# EAGLE design quad_copter_duino (EAGLE 5.06)
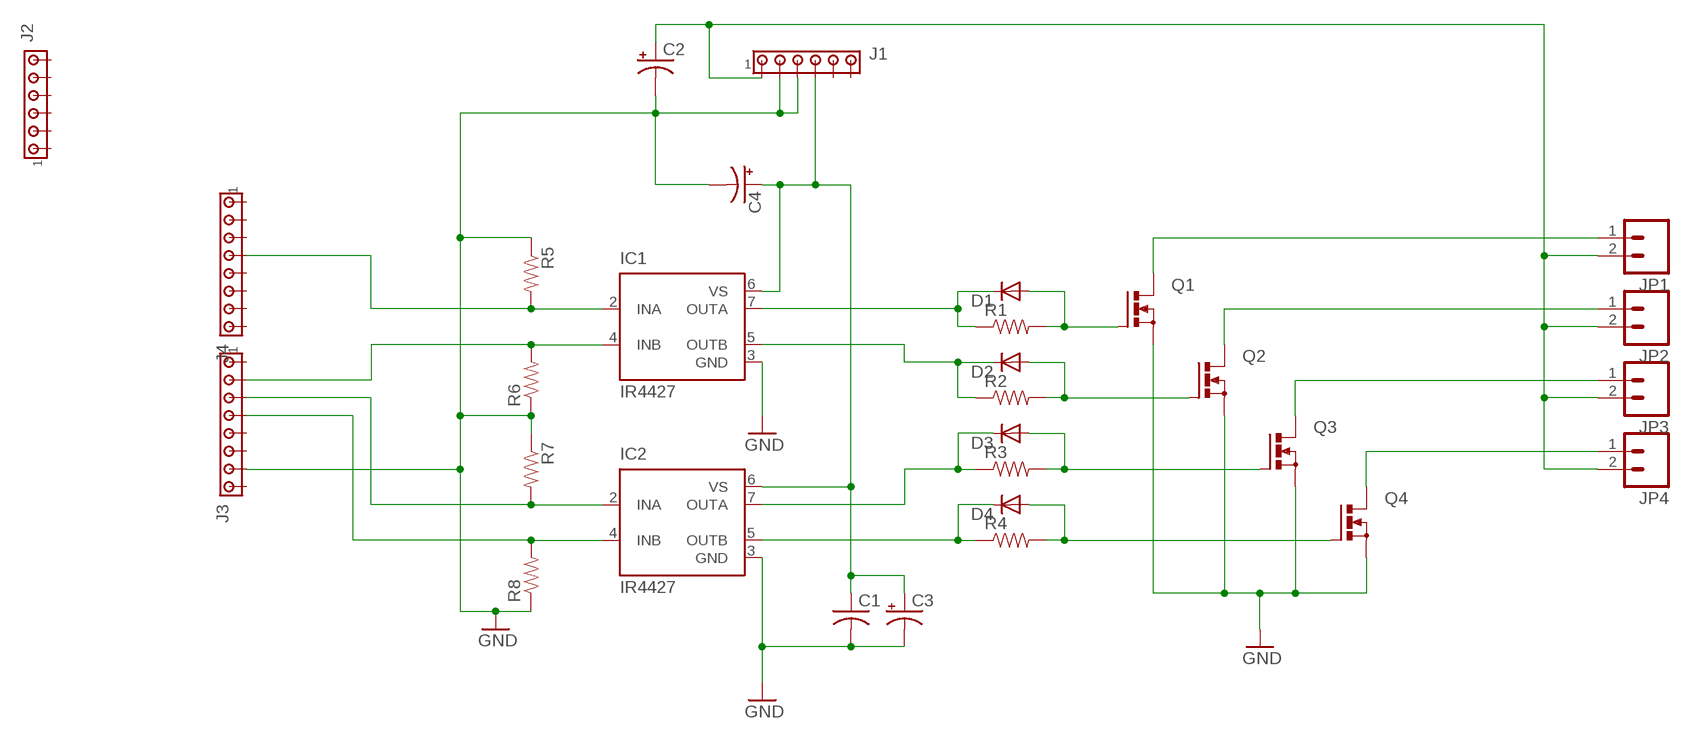
[diagram p0: schematic, sheet 1]

## Parts
C1  C-US025-025X050  [C025-025X050]
C2  CPOL-USE5-10.5  [E5-10,5]
C3  CPOL-USE5-10.5  [E5-10,5]
C4  CPOL-USE2.5-7  [E2,5-7]
D1  DIODE1N4148  [DIODE-1N4148]
D2  DIODE1N4148  [DIODE-1N4148]
D3  DIODE1N4148  [DIODE-1N4148]
D4  DIODE1N4148  [DIODE-1N4148]
IC1  IR4427  [DIL08]
IC2  IR4427  [DIL08]
J1  MTA06-100  [10X06MTA]
J2  MTA06-100  [10X06MTA]
J3  MTA08-100  [10X08MTA]
J4  MTA08-100  [10X08MTA]
JP1  M02PTH  [1X02]
JP2  M02PTH  [1X02]
JP3  M02PTH  [1X02]
JP4  M02PTH  [1X02]
Q1  PMOSFET_NTO220BV  [TO220BV]
Q2  PMOSFET_NTO220BV  [TO220BV]
Q3  PMOSFET_NTO220BV  [TO220BV]
Q4  PMOSFET_NTO220BV  [TO220BV]
R1  RESISTORPTH1  [AXIAL-0.3]
R2  RESISTORPTH1  [AXIAL-0.3]
R3  RESISTORPTH1  [AXIAL-0.3]
R4  RESISTORPTH1  [AXIAL-0.3]
R5  RESISTORPTH-1/6W  [1/6W-RES]
R6  RESISTORPTH-1/6W  [1/6W-RES]
R7  RESISTORPTH-1/6W  [1/6W-RES]
R8  RESISTORPTH-1/6W  [1/6W-RES]

## Nets
GND: C1.2 C2.- C3.- C4.- IC1.3(GND) IC2.3(GND) J1.4 J1.5 J3.7 Q1.S Q2.S Q3.S Q4.S R5.1 R6.1 R7.1 R8.1
N$1: C1.1 C3.+ C4.+ IC1.6(VS) IC2.6(VS) J1.3
N$2: C2.+ J1.6 JP1.2 JP2.2 JP3.2 JP4.2
N$9: JP4.1 Q4.D
N$10: JP3.1 Q3.D
N$11: JP2.1 Q2.D
N$12: JP1.1 Q1.D
N$13: D1.A Q1.G R1.P$2
N$14: D2.A Q2.G R2.P$2
N$15: D3.A Q3.G R3.P$2
N$16: D4.A Q4.G R4.P$2
N$17: D4.C IC2.5(OUTB) R4.P$1
N$18: D3.C IC2.7(OUTA) R3.P$1
N$19: D2.C IC1.5(OUTB) R2.P$1
N$20: D1.C IC1.7(OUTA) R1.P$1
N$21: IC2.4(INB) J3.4 R8.2
N$22: IC2.2(INA) J3.3 R7.2
N$23: IC1.4(INB) J3.2 R6.2
N$24: IC1.2(INA) J4.4 R5.2
Unconnected: J1.1 J1.2 J2.1 J2.2 J2.3 J2.4 J2.5 J2.6 J3.1 J3.5 J3.6 J3.8 J4.1 J4.2 J4.3 J4.5 J4.6 J4.7 J4.8

## Library data of the parts
C1 = rcl:C-US: CAPACITOR, American symbol
C2-C4 = rcl:CPOL-US: POLARIZED CAPACITOR, American symbol
D1-D4 = SparkFun:DIODE: Diode These are standard reverse protection diodes and small signal diodes. SMA package can handle up to about 1A. SOD-323 can handle about 200mA. What the SOD-323 package when ordering, there are some mfgs out there that are 5-pin packages.
IC1 IC2 = ir:IR4427: DUAL LOW SIDE DRIVER Source: ID4426.pdf
J1 J2 = con-amp:MTA06-100: AMP connector
J3 J4 = con-amp:MTA08-100: AMP connector
JP1-JP4 = SparkFun:M02: Header 2 Standard 2-pin 0.1" header. Use with straight break away headers (SKU : PRT-00116), right angle break away headers (PRT-00553), swiss pins (PRT-00743), machine pins (PRT-00117), and female headers (PRT-00115). Molex polarized connector foot print use with SKU : PRT-08233 with associated crimp pins and housings.
Q1-Q4 = transistor-power:PMOSFET_N: Power MOSFET N-Channel
R1-R8 = SparkFun:RESISTOR: Resistor Basic schematic elements and footprints for 0603, 1206, and PTH 1/10th watt (small) resistors.

## Board
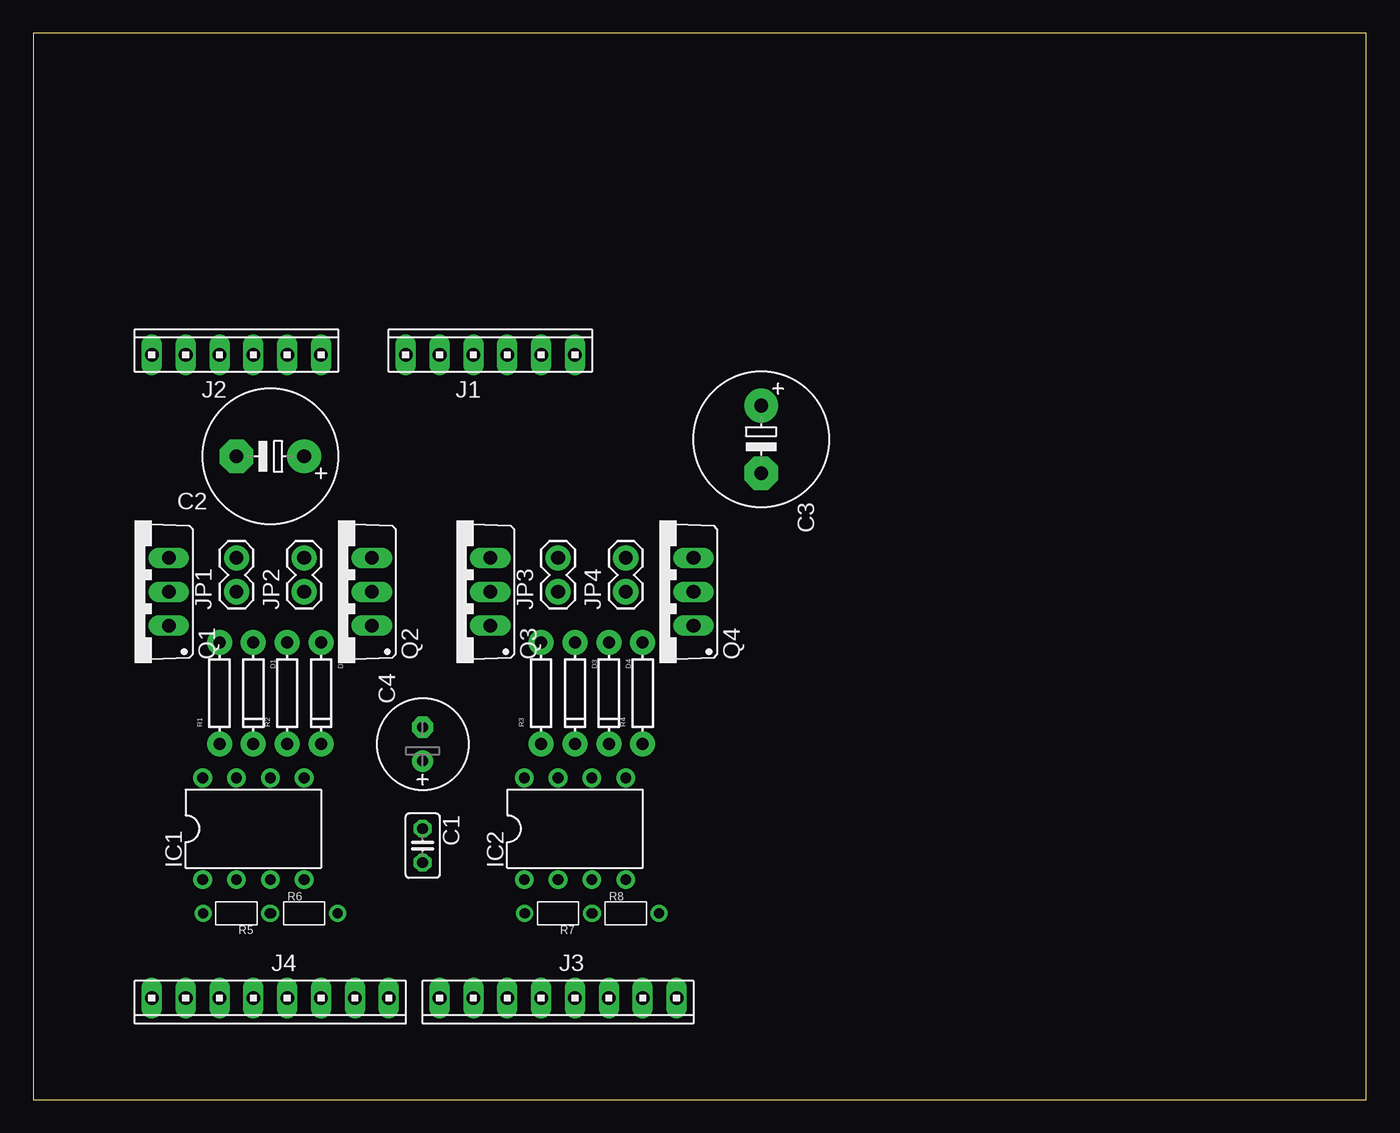
[diagram p1: board, top side]
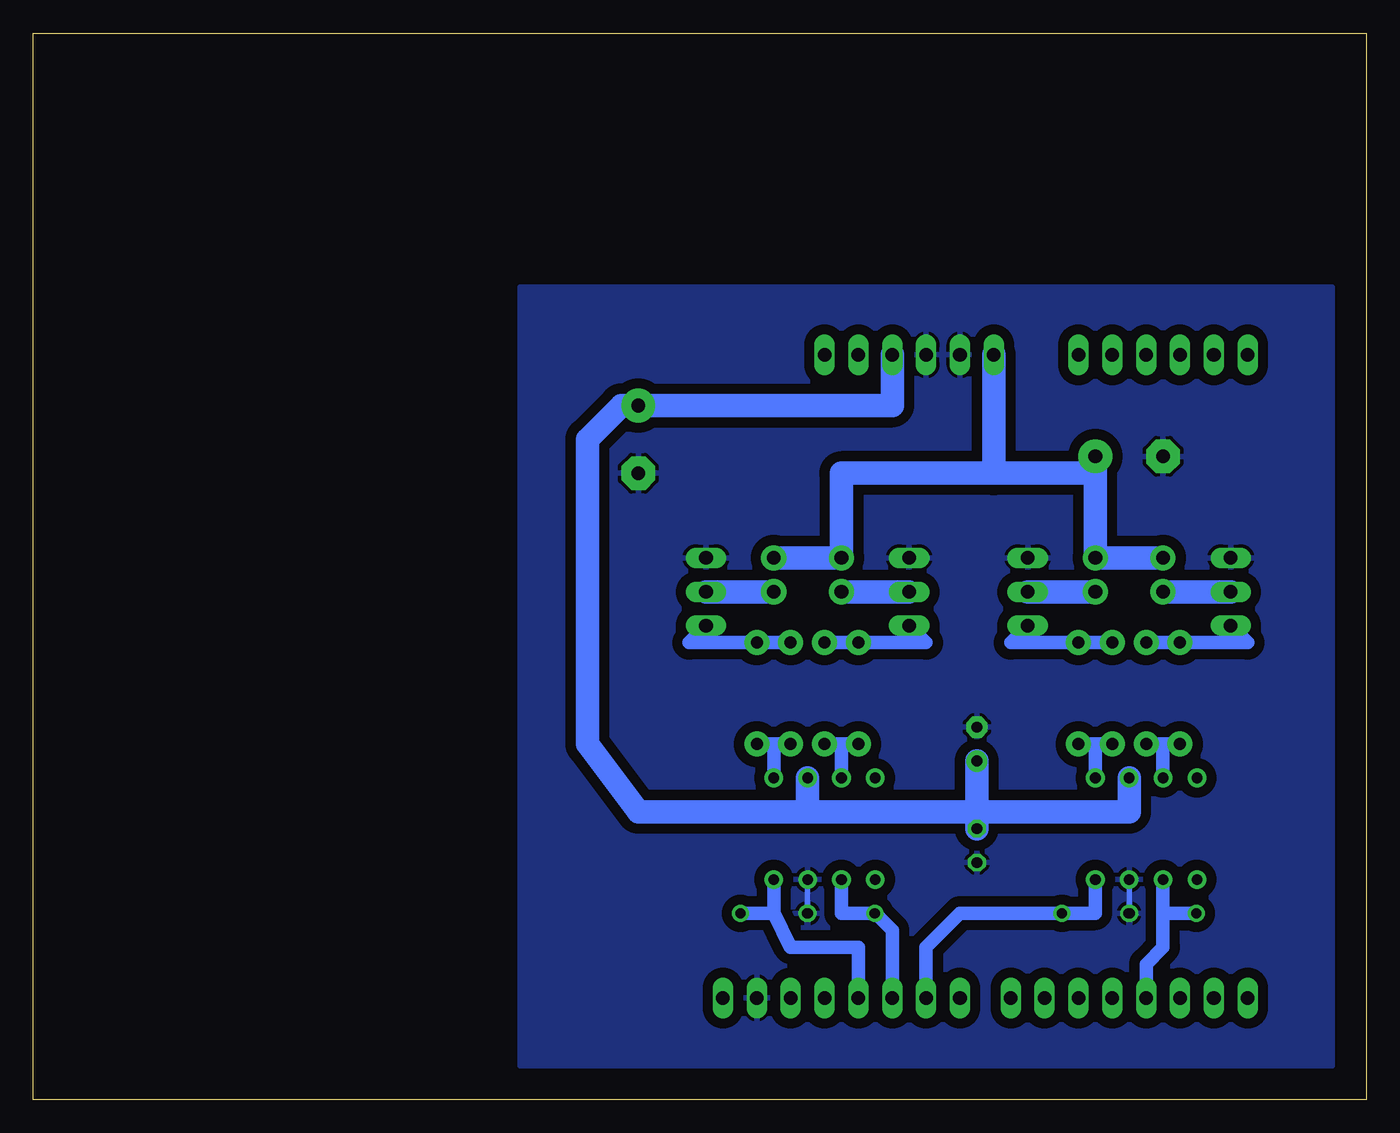
[diagram p2: board, bottom side, seen from below]

Size 100 x 80 mm. Coordinates in mm from the lower left corner, seen from the top.
Outline: 0,0 100,0 100,80 0,80 0,0
Copper layers (1*16): Top 0.035mm / dielectric 1.5mm / Bottom 0.035mm
Design rules "default *": minimum track width 10mil, minimum drill 24mil, track to track 30mil, track to pad 30mil, pad to pad 8mil, via to via 8mil, smd to smd 8mil, copper to edge 40mil, drill to drill 8mil, minimum pad ring 10mil, minimum via ring 8mil, stop-mask expansion 4mil, vias tented up to drill 0mil, thermal gap 10mil
Holes 0.6 mm at -26.67,53.34

### Footprints (pad centres in the part's own frame; a part is rotated, then mirrored left to right if it is on the bottom)
C025-025X050 = drill 0.813 octagon: 1 -1.27,0; 2 1.27,0
E5-10,5 = drill 1.016 pad 2.54 round: + -2.54,0 | drill 1.016 pad 2.54 octagon: - 2.54,0
E2,5-7 = drill 0.813 pad 1.6 round: + -1.27,0 | drill 0.813 pad 1.6 octagon: - 1.27,0
DIODE-1N4148 = drill 0.9 pad 1.88 round: A -3.81,0; C 3.81,0
DIL08 = drill 0.8 pad 1.4 round: 1 -3.81,-3.81; 2 -1.27,-3.81; 3 1.27,-3.81; 4 3.81,-3.81; 5 3.81,3.81; 6 1.27,3.81; 7 -1.27,3.81; 8 -3.81,3.81
10X06MTA = drill 1.016 long: 1 6.35,0; 2 3.81,0; 3 1.27,0; 4 -1.27,0; 5 -3.81,0; 6 -6.35,0
10X08MTA = drill 1.016 long: 1 8.89,0; 2 6.35,0; 3 3.81,0; 4 1.27,0; 5 -1.27,0; 6 -3.81,0; 7 -6.35,0; 8 -8.89,0
1X02 = drill 1.016 pad 1.88 round: 1 0,0; 2 2.54,0
TO220BV = drill 1.016 long: D 0,-2.54; G -2.54,-2.54; S 2.54,-2.54
AXIAL-0.3 = drill 0.9 pad 1.88 round: P$1 -3.81,0; P$2 3.81,0
1/6W-RES = drill 0.762 round: 1 -2.5,0; 2 2.5,0

### Placement (x,y rotation side)
C1  29.21,19.05 270 top
C2  17.78,48.26 180 top
C3  54.61,49.53 270 top
C4  29.21,26.67 90 top
D1  16.51,30.48 270 top
D2  21.59,30.48 270 top
D3  40.64,30.48 270 top
D4  43.18,30.48 270 top
IC1  16.51,20.32 0 top
IC2  40.64,20.32 0 top
J1  34.29,55.88 0 top
J2  15.24,55.88 0 top
J3  39.37,7.62 180 top
J4  17.78,7.62 180 top
JP1  15.24,38.1 90 top
JP2  20.32,38.1 90 top
JP3  39.37,38.1 90 top
JP4  44.45,38.1 90 top
Q1  7.62,38.1 90 top
Q2  22.86,38.1 90 top
Q3  31.75,38.1 90 top
Q4  46.99,38.1 90 top
R1  13.97,30.48 90 top
R2  19.05,30.48 90 top
R3  38.1,30.48 90 top
R4  45.72,30.48 90 top
R5  15.24,13.97 180 top
R6  20.32,13.97 0 top
R7  39.37,13.97 180 top
R8  44.45,13.97 0 top

### Tracks (layer width: path | path; a pad name or v marks a point on that pad's centre or on a via)
GND
  Bottom 0.406: 41.91,13.97 IC2.3 | 17.78,13.97 IC1.3
  pour Bottom: 2.54,60.96 2.54,2.54 63.5,2.54 63.5,60.96
N$1
  Bottom 1.778: 29.21,21.59 C1.1 | 29.21,21.59 C4.+ | 29.21,21.59 17.78,21.59 IC1.6 | 29.21,21.59 41.91,21.59 | 41.91,21.59 IC2.6 | 41.91,21.59 54.61,21.59 58.42,26.67 58.42,49.53 55.88,52.07 C3.+ 35.56,52.07 J1.3
N$2
  Bottom 1.016: 20.32,46.99 JP2.2 JP1.2 | JP3.2 JP4.2
  Bottom 1.778: 27.94,46.99 J1.6 | 27.94,46.99 20.32,46.99 C2.+ JP2.2 JP1.2 | 27.94,46.99 39.37,46.99 JP3.2 JP4.2
N$9
  Bottom 1.016: JP4.1 Q4.D
  Bottom 1.778: JP4.1 Q4.D
N$10
  Bottom 1.016: Q3.D JP3.1
  Bottom 1.778: Q3.D JP3.1
N$11
  Bottom 1.016: JP2.1 Q2.D
  Bottom 1.778: JP2.1 Q2.D
N$12
  Bottom 1.016: Q1.D JP1.1
  Bottom 1.778: Q1.D JP1.1
N$13
  Bottom 1.016: Q1.G 8.89,34.29 D1.A R1.P$2
N$14
  Bottom 0.406: R2.P$2 D2.A
  Bottom 1.016: R2.P$2 26.67,34.29 Q2.G
N$15
  Bottom 1.016: D3.A R3.P$2 33.02,34.29 Q3.G
N$16
  Bottom 0.406: D4.A R4.P$2
  Bottom 1.016: D4.A 50.8,34.29 Q4.G
N$17
  Bottom 1.016: IC2.5 44.45,26.67 D4.C R4.P$1
N$18
  Bottom 1.016: R3.P$1 D3.C 39.37,26.67 IC2.7
N$19
  Bottom 1.016: IC1.5 20.32,26.67 R2.P$1 D2.C
N$20
  Bottom 1.016: IC1.7 15.24,26.67 D1.C R1.P$1
N$21
  Bottom 0.406: R8.2 46.99,13.97
  Bottom 1.016: 44.45,13.97 IC2.4 | 44.45,13.97 R8.2 | J3.4 38.1,11.43 43.18,11.43 44.45,13.97
N$22
  Bottom 0.406: 36.83,13.97 R7.2
  Bottom 1.016: IC2.2 39.37,13.97 R7.2 | 36.83,13.97 35.56,12.7 J3.3
N$23
  Bottom 0.406: R6.2 22.86,13.97
  Bottom 1.016: IC1.4 20.32,13.97 R6.2 | 22.86,13.97 30.48,13.97 33.02,11.43 J3.2
N$24
  Bottom 0.406: R5.2 12.7,13.97
  Bottom 1.016: 15.24,13.97 IC1.2 | 15.24,13.97 R5.2 | J4.4 16.51,10.16 15.24,11.43 15.24,13.97